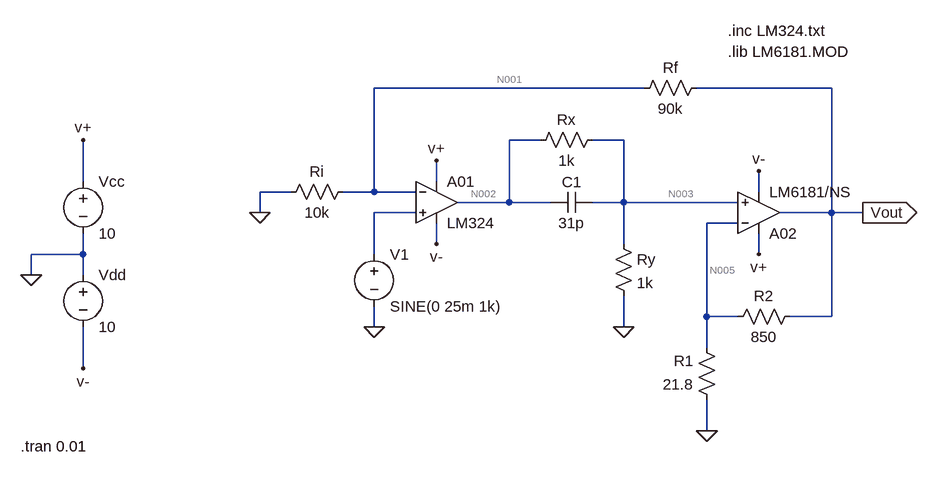
[diagram p0: schematic VFA-CFA-Compensado.asc]
VFA-CFA-Compensado.asc, the LTspice schematic file:
Version 4
SHEET 1 1344 680
WIRE 832 -96 416 -96
WIRE 1120 -96 912 -96
WIRE 672 -16 624 -16
WIRE 800 -16 752 -16
WIRE -32 48 -32 -16
WIRE 512 48 512 16
WIRE 288 64 240 64
WIRE 416 64 416 -96
WIRE 416 64 368 64
WIRE 480 64 416 64
WIRE 1008 64 1008 32
WIRE 624 80 624 -16
WIRE 624 80 544 80
WIRE 688 80 624 80
WIRE 800 80 800 -16
WIRE 800 80 752 80
WIRE 976 80 800 80
WIRE 240 96 240 64
WIRE 480 96 416 96
WIRE 1120 96 1120 -96
WIRE 1120 96 1040 96
WIRE 1168 96 1120 96
WIRE 976 112 928 112
WIRE 512 144 512 112
WIRE 800 144 800 80
WIRE -32 160 -32 128
WIRE -32 160 -112 160
WIRE 416 160 416 96
WIRE 1008 160 1008 128
WIRE -112 192 -112 160
WIRE -32 192 -32 160
WIRE 928 256 928 112
WIRE 976 256 928 256
WIRE 1120 256 1120 96
WIRE 1120 256 1056 256
WIRE 416 272 416 240
WIRE 800 272 800 224
WIRE 928 304 928 256
WIRE -32 336 -32 272
WIRE 928 432 928 384
FLAG -112 192 0
FLAG -32 -16 v+
FLAG -32 336 v-
FLAG 240 96 0
FLAG 512 16 v+
FLAG 512 144 v-
FLAG 1008 32 v-
FLAG 1008 160 v+
FLAG 416 272 0
FLAG 928 432 0
FLAG 1168 96 Vout
IOPIN 1168 96 Out
FLAG 800 272 0
SYMBOL voltage -32 32 R0
WINDOW 123 0 0 Left 0
WINDOW 39 0 0 Left 0
SYMATTR InstName Vcc
SYMATTR Value 10
SYMBOL voltage -32 176 R0
WINDOW 123 0 0 Left 0
WINDOW 39 0 0 Left 0
SYMATTR InstName Vdd
SYMATTR Value 10
SYMBOL res 384 48 R90
WINDOW 0 0 56 VBottom 2
WINDOW 3 32 56 VTop 2
SYMATTR InstName Ri
SYMATTR Value 10k
SYMBOL OpAmps\\opamp2 512 16 R0
SYMATTR InstName A01
SYMATTR Value LM324
SYMBOL res 928 -112 R90
WINDOW 0 0 56 VBottom 2
WINDOW 3 32 56 VTop 2
SYMATTR InstName Rf
SYMATTR Value 90k
SYMBOL OpAmps\\opamp2 1008 160 M180
SYMATTR InstName A02
SYMATTR Value LM6181/NS
SYMBOL voltage 416 144 R0
WINDOW 123 0 0 Left 0
WINDOW 39 0 0 Left 0
SYMATTR InstName V1
SYMATTR Value SINE(0 25m 1k)
SYMBOL res 1072 240 R90
WINDOW 0 0 56 VBottom 2
WINDOW 3 32 56 VTop 2
SYMATTR InstName R2
SYMATTR Value 850
SYMBOL res 944 400 R180
WINDOW 0 36 76 Left 2
WINDOW 3 36 40 Left 2
SYMATTR InstName R1
SYMATTR Value 21.8
SYMBOL cap 752 64 R90
WINDOW 0 0 32 VBottom 2
WINDOW 3 32 32 VTop 2
SYMATTR InstName C1
SYMATTR Value 31p
SYMBOL res 768 -32 R90
WINDOW 0 0 56 VBottom 2
WINDOW 3 32 56 VTop 2
SYMATTR InstName Rx
SYMATTR Value 1k
SYMBOL res 784 128 R0
SYMATTR InstName Ry
SYMATTR Value 1k
TEXT 960 -184 Left 2 !.inc LM324.txt
TEXT 960 -152 Left 2 !.lib LM6181.MOD
TEXT -128 456 Left 2 !.tran 0.01

The netlist it stands for:
* VFA-CFA-Compensado.asc
Vcc v+ 0 10
Vdd 0 v- 10
Ri N001 0 10k
XA01 N004 N001 v+ v- N002 LM324  ; pins In+ In- V+ V- OUT
Rf Vout N001 90k
XA02 N003 N005 v+ v- Vout LM6181/NS  ; pins In+ In- V+ V- OUT
V1 N004 0 SINE(0 25m 1k)
R2 Vout N005 850
R1 0 N005 21.8
C1 N003 N002 31p
Rx N003 N002 1k
Ry N003 0 1k
.inc LM324.txt
.lib LM6181.MOD
.tran 0.01
.backanno
.end

* Results of the author's LTspice run, read from the files saved beside the schematic
* Operating Point, zero values left out:
*   V(v+) = 10 V
*   V(v-) = -10 V
*   V(n001) = -33.62 µV
*   V(n002) = -3.573 mV
*   V(vout) = -2.131 mV
*   V(n005) = 63.61 µV
*   V(n003) = -2.336 mV
*   I(Ri) = -3.362 nA
*   I(Rf) = -23.3 nA
*   I(R2) = -2.582 µA
*   I(R1) = -2.918 µA
*   I(Rx) = 1.237 µA
*   I(Ry) = -2.336 µA
*   I(Vcc) = -7.426 mA
*   I(Vdd) = -7.424 mA
*   I(V1) = 19.92 nA
*   Ix(a01:1) = -19.92 nA
*   Ix(a01:2) = -19.94 nA
*   Ix(a01:3) = 669.9 µA
*   Ix(a01:4) = -669.8 µA
*   Ix(a01:5) = 1.237 µA
*   Ix(a02:1) = 1.1 µA
*   Ix(a02:2) = -5.499 µA
*   Ix(a02:99) = 6.756 mA
*   Ix(a02:50) = -6.754 mA
*   Ix(a02:41) = 2.605 µA
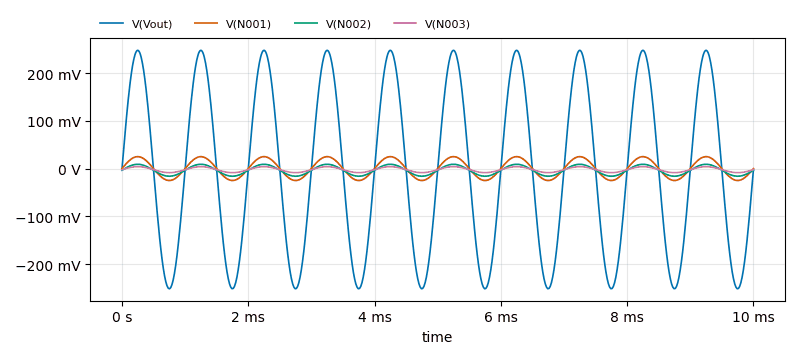
[diagram p1: Transient Analysis of VFA-CFA-Compensado.asc, plotted from the saved traces]
* Transient Analysis, 1 run:
*   V(Vout): min -251.8 mV, max 247.5 mV, average -2.057 mV, rms 176.6 mV, last -2.26 mV
*   V(N001): min -25 mV, max 24.93 mV, average -26.25 µV, rms 17.66 mV, last -46.48 µV
*   V(N002): min -16.08 mV, max 8.937 mV, average -3.569 mV, rms 9.542 mV, last -3.58 mV
*   V(N003): min -8.592 mV, max 3.918 mV, average -2.335 mV, rms 5.003 mV, last -2.339 mV